# Altium project EzPowerV4 - REV09.PrjPcb (part 1 of 7)
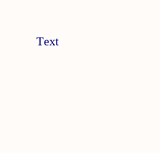
[diagram p0: Hardware_Architecture.SchDoc, left]
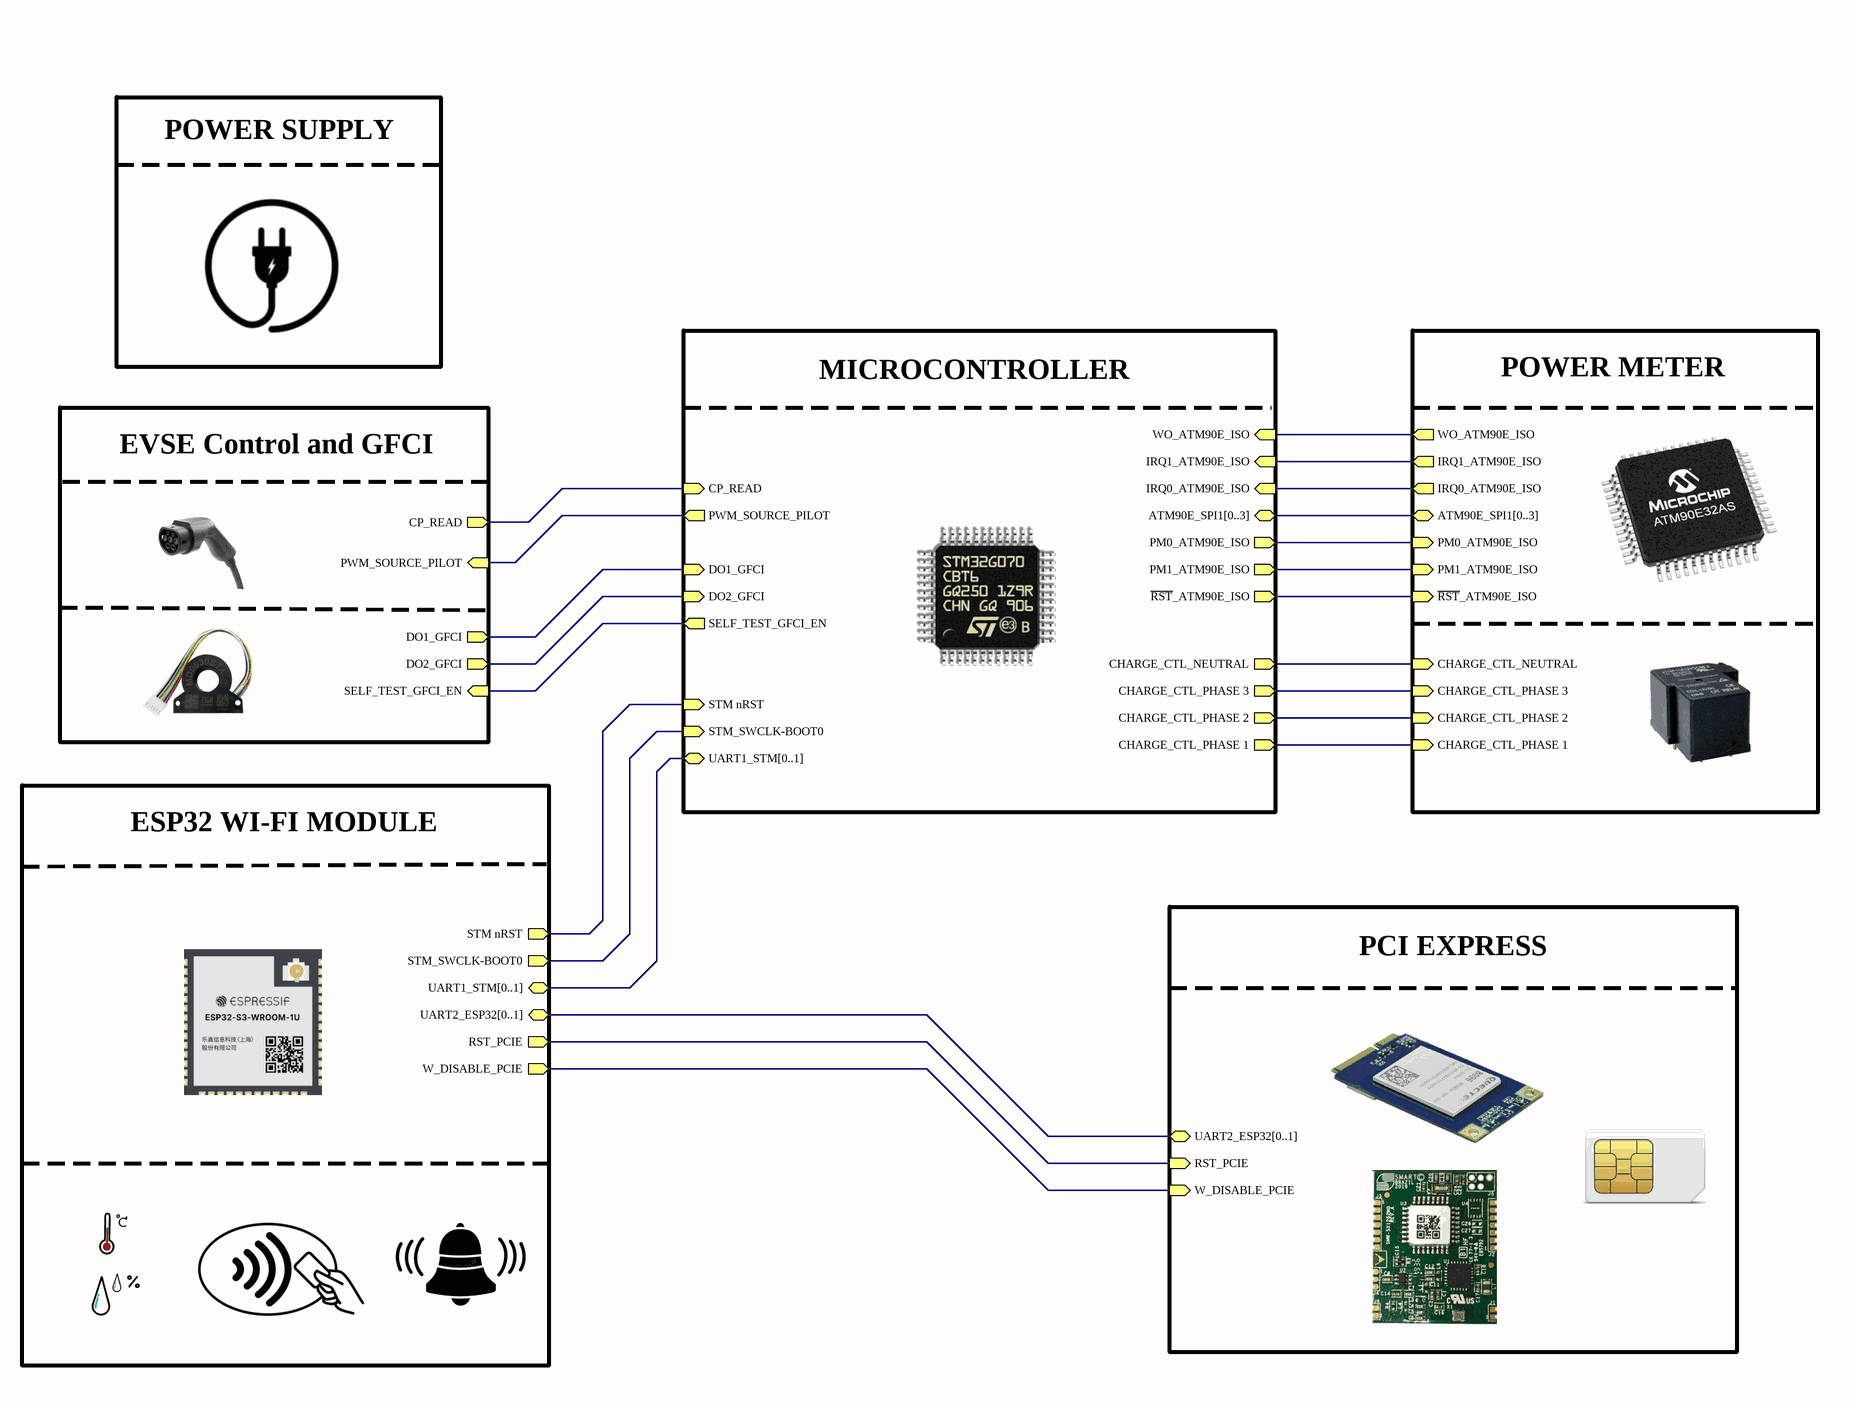
[diagram p1: Hardware_Architecture.SchDoc, right]
7 sheets, 340 parts. Net scope: global (net labels, ports and power ports of the same name join across sheets).
Board files: EzPowerV4 - REV09.PcbDoc, EzPowerV4 - REV09 - Painel x4.PcbDoc, EzPowerV4 - REV09 - Painel x2.PcbDoc
Sheets:
  Hardware_Architecture.SchDoc
    MICROCONTROLLER = Microcontroller.SchDoc
    POWER METER = Power Meter.SchDoc
    ESP32 WI-FI MODULE = ESP32 WI-FI Module.SchDoc
    PCI EXPRESS = PCI Express.SchDoc
    EVSE Control and GFCI = EVSE Control and GFCI.SchDoc
    POWER SUPPLY = Power Supply.SchDoc

## Sheet Hardware_Architecture.SchDoc: Hardware Architecture
size A2; ApprovedBy: JTS; CheckedBy: JTS; DrawnBy: EBC; DocumentNumber: -; Revision: 09; SheetNumber: 1; SheetTotal: 7; SenaiProjectName: EzPower v4

### Sub-sheets
ESP32 WI-FI MODULE = ESP32 WI-FI Module.SchDoc: RST_PCIE (out), W_DISABLE_PCIE (out), UART2_ESP32[0..1] (bidir), UART1_STM[0..1] (bidir), STM_SWCLK-BOOT0 (out), STM nRST (out)
EVSE Control and GFCI = EVSE Control and GFCI.SchDoc: PWM_SOURCE_PILOT (in), CP_READ (out), DO2_GFCI (out), DO1_GFCI (out), SELF_TEST_GFCI_EN (in)
MICROCONTROLLER = Microcontroller.SchDoc: PWM_SOURCE_PILOT (out), CP_READ (in), PM0_ATM90E_ISO (out), PM1_ATM90E_ISO (out), IRQ1_ATM90E_ISO (in), IRQ0_ATM90E_ISO (in), WO_ATM90E_ISO (in), ~{RST}_ATM90E_ISO (out), UART1_STM[0..1] (bidir), ATM90E_SPI1[0..3] (bidir), CHARGE_CTL_NEUTRAL (out), CHARGE_CTL_PHASE 3 (out), CHARGE_CTL_PHASE 2 (out), CHARGE_CTL_PHASE 1 (out), SELF_TEST_GFCI_EN (out), DO2_GFCI (in), DO1_GFCI (in), STM nRST (in), STM_SWCLK-BOOT0 (in)
PCI EXPRESS = PCI Express.SchDoc: RST_PCIE (in), UART2_ESP32[0..1] (bidir), W_DISABLE_PCIE (in)
POWER METER = Power Meter.SchDoc: IRQ1_ATM90E_ISO (out), IRQ0_ATM90E_ISO (out), WO_ATM90E_ISO (out), PM1_ATM90E_ISO (in), PM0_ATM90E_ISO (in), ~{RST}_ATM90E_ISO (in), ATM90E_SPI1[0..3] (bidir), CHARGE_CTL_PHASE 2 (in), CHARGE_CTL_PHASE 1 (in), CHARGE_CTL_NEUTRAL (in), CHARGE_CTL_PHASE 3 (in)
POWER SUPPLY = Power Supply.SchDoc: no entries

### Nets
(unnamed): sheet MICROCONTROLLER/PWM_SOURCE_PILOT, sheet EVSE Control and GFCI/PWM_SOURCE_PILOT
(unnamed): sheet MICROCONTROLLER/CP_READ, sheet EVSE Control and GFCI/CP_READ
(unnamed): sheet MICROCONTROLLER/PM0_ATM90E_ISO, sheet POWER METER/PM0_ATM90E_ISO
(unnamed): sheet MICROCONTROLLER/PM1_ATM90E_ISO, sheet POWER METER/PM1_ATM90E_ISO
(unnamed): sheet MICROCONTROLLER/IRQ1_ATM90E_ISO, sheet POWER METER/IRQ1_ATM90E_ISO
(unnamed): sheet MICROCONTROLLER/IRQ0_ATM90E_ISO, sheet POWER METER/IRQ0_ATM90E_ISO
(unnamed): sheet MICROCONTROLLER/~{RST}_ATM90E_ISO, sheet POWER METER/~{RST}_ATM90E_ISO
(unnamed): sheet MICROCONTROLLER/CHARGE_CTL_PHASE 3, sheet POWER METER/CHARGE_CTL_PHASE 3
(unnamed): sheet MICROCONTROLLER/CHARGE_CTL_PHASE 2, sheet POWER METER/CHARGE_CTL_PHASE 2
(unnamed): sheet MICROCONTROLLER/CHARGE_CTL_PHASE 1, sheet POWER METER/CHARGE_CTL_PHASE 1
(unnamed): sheet MICROCONTROLLER/SELF_TEST_GFCI_EN, sheet EVSE Control and GFCI/SELF_TEST_GFCI_EN
(unnamed): sheet MICROCONTROLLER/DO2_GFCI, sheet EVSE Control and GFCI/DO2_GFCI
(unnamed): sheet MICROCONTROLLER/STM nRST, sheet ESP32 WI-FI MODULE/STM nRST
(unnamed): sheet MICROCONTROLLER/STM_SWCLK-BOOT0, sheet ESP32 WI-FI MODULE/STM_SWCLK-BOOT0
(unnamed): sheet ESP32 WI-FI MODULE/RST_PCIE, sheet PCI EXPRESS/RST_PCIE
(unnamed): sheet ESP32 WI-FI MODULE/W_DISABLE_PCIE, sheet PCI EXPRESS/W_DISABLE_PCIE

### Buses and harness runs
bus sheet ESP32 WI-FI MODULE/UART1_STM[0..1] = sheet MICROCONTROLLER/UART1_STM[0..1]
bus sheet ESP32 WI-FI MODULE/UART2_ESP32[0..1] = sheet PCI EXPRESS/UART2_ESP32[0..1]

### Notes on the sheet
- Text
- Title:
- Size:
- Project:
- Revision:
- Date:
- Time:
- Variant:
- Drawn by:
- Checked by:
- A2
- Approved by:
- Sheet
- of

## Sheet Microcontroller.SchDoc: Microcontroller
size A2; ApprovedBy: JTS; CheckedBy: JTS; DrawnBy: EBC; DocumentNumber: -; Revision: 09; SheetNumber: 4; SheetTotal: 7; SenaiProjectName: EzPower v4
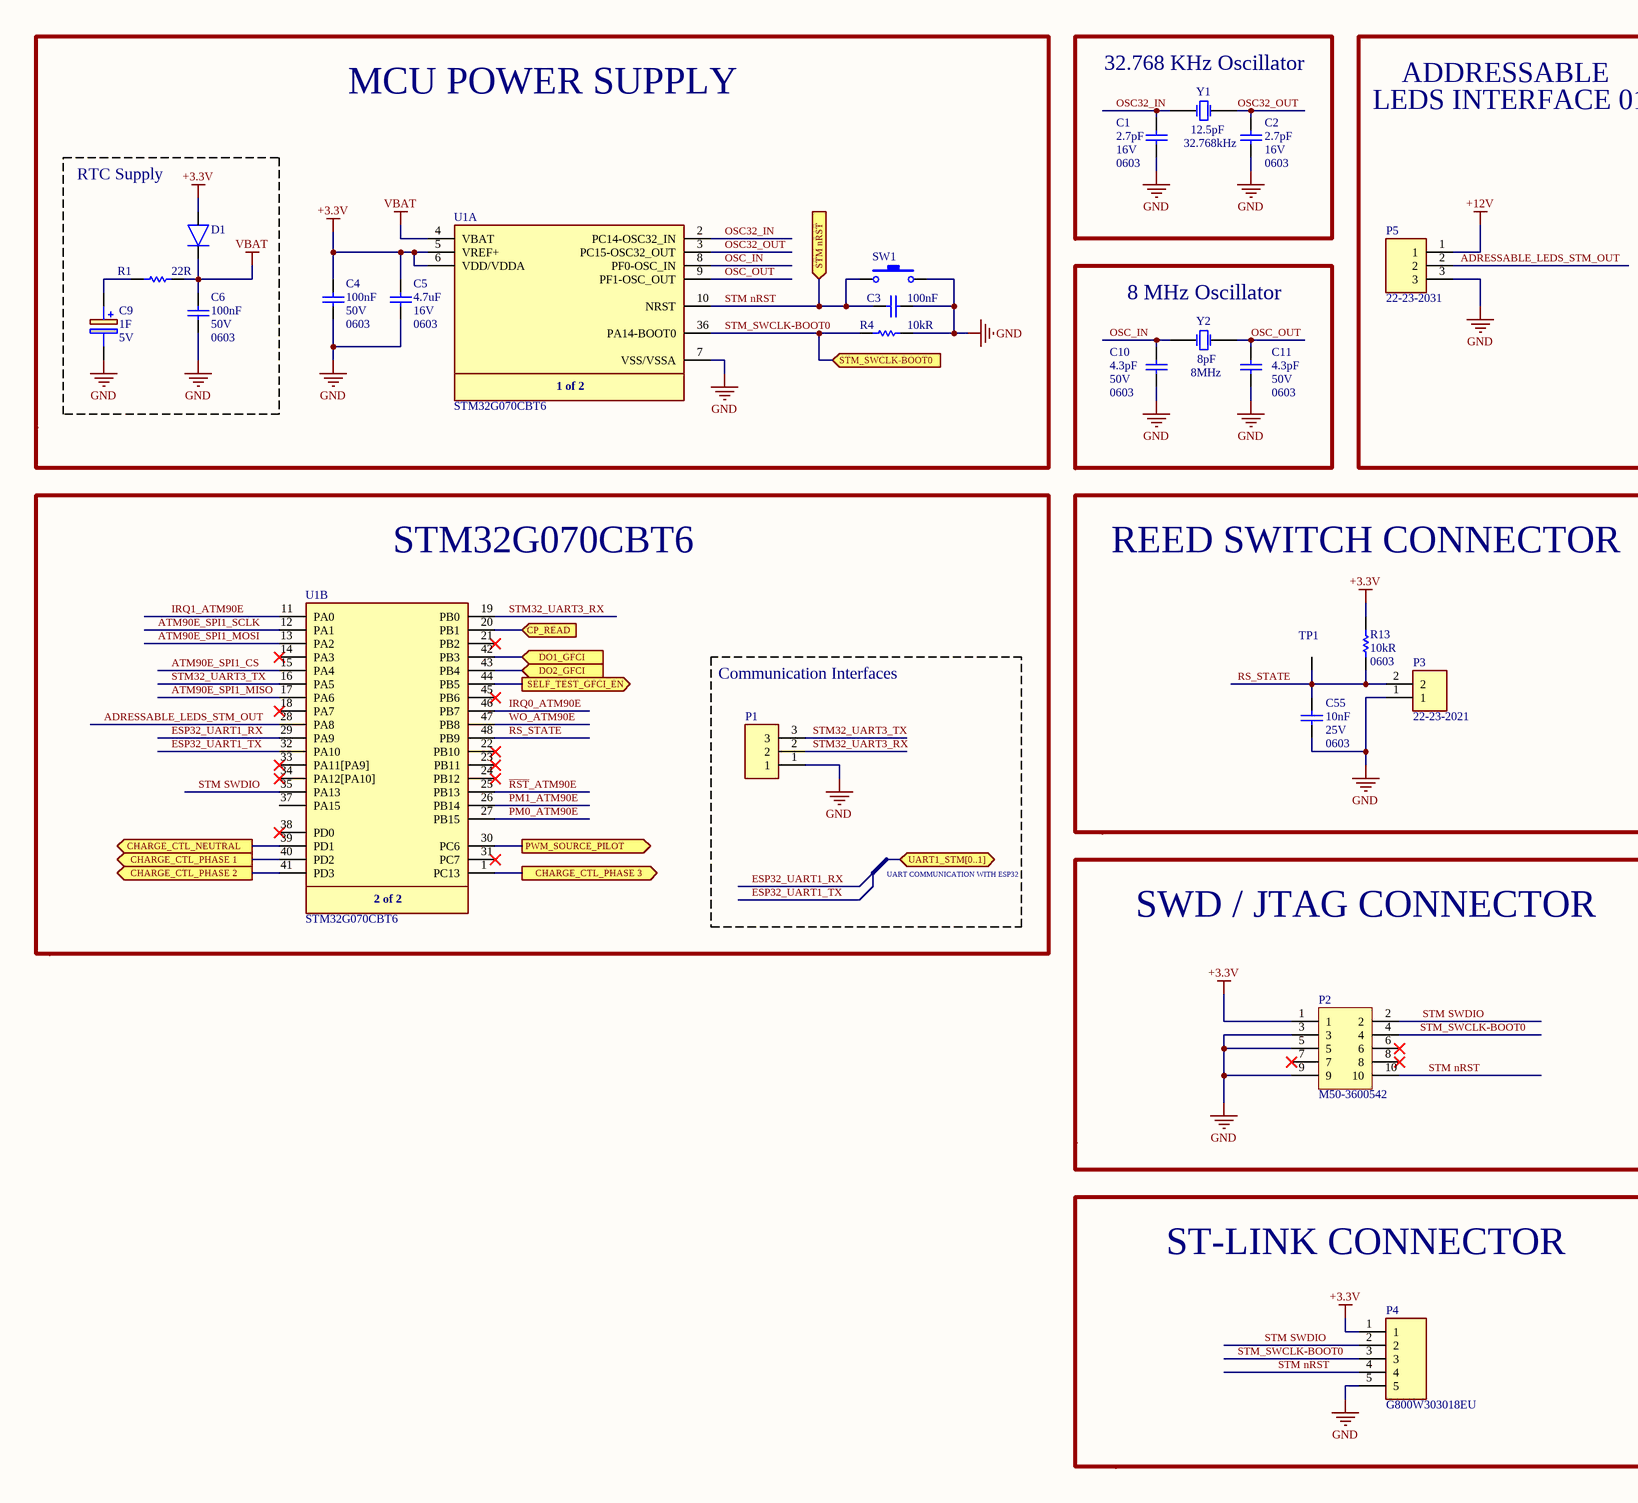
[diagram p2: Microcontroller.SchDoc, left]
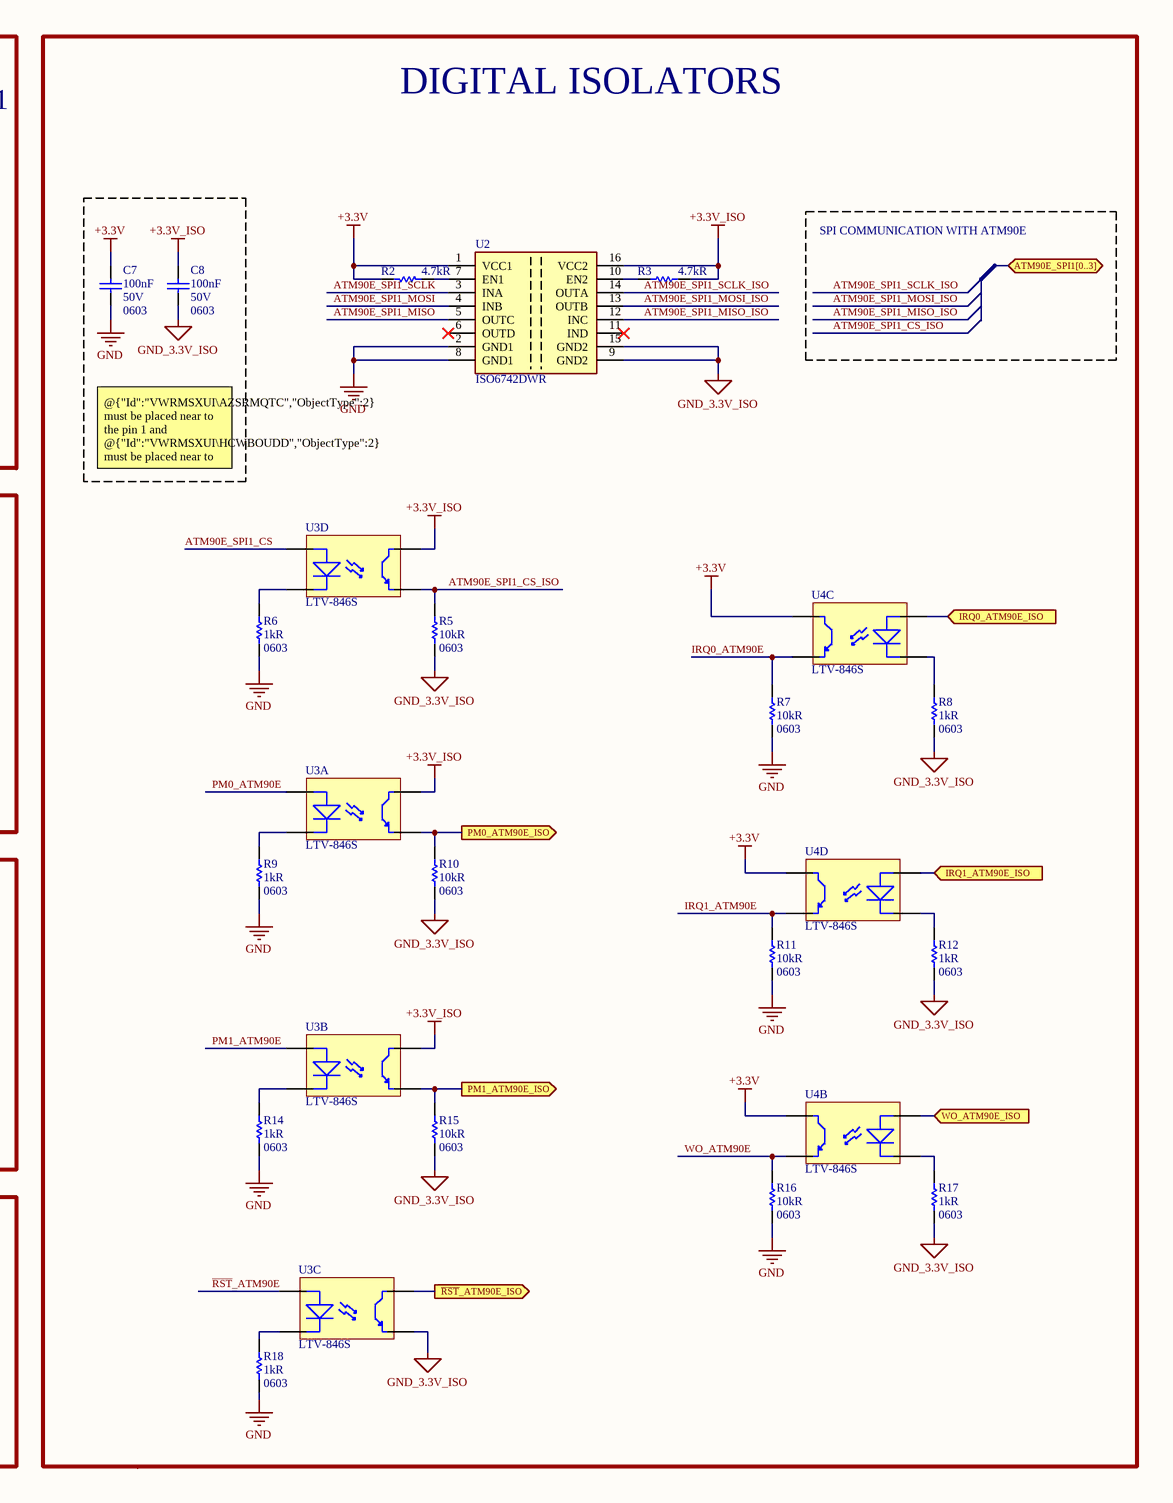
[diagram p3: Microcontroller.SchDoc, right]

### Parts
C1  Voltage Rating (DC): 16V  Case Code (Imperial): 0603  Capacitance: 2.7pF  [C0603]  (hidden comment: VJ0603A2R7DXJPW1BC)
C2  Voltage Rating (DC): 16V  Case Code (Imperial): 0603  Capacitance: 2.7pF  [C0603]  (hidden comment: VJ0603A2R7DXJPW1BC)
C3  value 100nF  [C0603]  (hidden comment: CC0603MRX7R9BB104)
C4  value 100nF  Case/Package: 0603  Voltage Rating: 50V  [C0603]  (hidden comment: CC0603MRX7R9BB104)
C5  value 4.7uF  Case Code (Imperial): 0603  Voltage Rating: 16V  [C0603]  (hidden comment: CL10A475KO8NNNC)
C6  value 100nF  Case/Package: 0603  Voltage Rating: 50V  [C0603]  (hidden comment: CC0603MRX7R9BB104)
C7  value 100nF  Case/Package: 0603  Voltage Rating: 50V  [C0603]  (hidden comment: CC0603MRX7R9BB104)
C8  value 100nF  Case/Package: 0603  Voltage Rating: 50V  [C0603]  (hidden comment: CC0603MRX7R9BB104)
C9  value 1F  Voltage Rating: 5V  [CAP 8MMX18MM]  (hidden comment: SCMR18C105PRBA0)
C10  value 4.3pF  Case Code (Imperial): 0603  Voltage Rating: 50V  [C0603]  (hidden comment: CC0603CRNPO9BN4R3)
C11  value 4.3pF  Case Code (Imperial): 0603  Voltage Rating: 50V  [C0603]  (hidden comment: CC0603CRNPO9BN4R3)
C55  Voltage Rating: 25V  Capacitance: 10nF  Case Code (Imperial): 0603  [C0603]  (hidden comment: C_0603_0.01uF_25V_10%)
D1  1N4448W-TP  [SOD123]  (value not drawn)
P1  10129378-903001BLF  [HEADER_2.54MM_3POS_PTH]  (value not drawn)
P2  M50-3600542  [HEADER_10POS_1.27MM_SMT]
P3  22-23-2021  [HEADER_KK_2.54MM_2POS]
P4  G800W303018EU  [HEADER_2.54MM_5POS]
P5  22-23-2031  [HEADER_2.54MM_3POS]
R1  Resistance: 22R  [R0603]  (hidden comment: CRCW060322R0FKEAC)
R2  Resistance: 4.7kR  [R0603]  (hidden comment: R_0603_4.7k_1%_1/10W)
R3  Resistance: 4.7kR  [R0603]  (hidden comment: R_0603_4.7k_1%_1/10W)
R4  value 10kR  [R0603]  (hidden comment: CRCW060310K0JNEBC)
R5  value 10kR  Case/Package: 0603  [R0603]  (hidden comment: CRCW060310K0JNEBC)
R6  Size Code: 0603  Resistance: 1kR  [R0603]  (hidden comment: R_0603_1kR_1%_1/10W)
R7  value 10kR  Case/Package: 0603  [R0603]  (hidden comment: CRCW060310K0JNEBC)
R8  Size Code: 0603  Resistance: 1kR  [R0603]  (hidden comment: R_0603_1kR_1%_1/10W)
R9  Size Code: 0603  Resistance: 1kR  [R0603]  (hidden comment: R_0603_1kR_1%_1/10W)
R10  value 10kR  Case/Package: 0603  [R0603]  (hidden comment: CRCW060310K0JNEBC)
R11  value 10kR  Case/Package: 0603  [R0603]  (hidden comment: CRCW060310K0JNEBC)
R12  Size Code: 0603  Resistance: 1kR  [R0603]  (hidden comment: R_0603_1kR_1%_1/10W)
R13  value 10kR  Case/Package: 0603  [R0603]  (hidden comment: CRCW060310K0JNEBC)
R14  Size Code: 0603  Resistance: 1kR  [R0603]  (hidden comment: R_0603_1kR_1%_1/10W)
R15  value 10kR  Case/Package: 0603  [R0603]  (hidden comment: CRCW060310K0JNEBC)
R16  value 10kR  Case/Package: 0603  [R0603]  (hidden comment: CRCW060310K0JNEBC)
R17  Size Code: 0603  Resistance: 1kR  [R0603]  (hidden comment: R_0603_1kR_1%_1/10W)
R18  Size Code: 0603  Resistance: 1kR  [R0603]  (hidden comment: R_0603_1kR_1%_1/10W)
SW1  PTS810SJM250SMTRLFS  [PUSH BUTTON 4.2mm x 3.2 mm]  (value not drawn)
TP1  S2761-46R  [TP_S276146R]  (value not drawn)
U1  STM32G070CBT6  [LQFP-48]  (parts A,B of 2)
U2  ISO6742DWR  [SOIC-16]
U3  LTV-846S  [PDIP-16]  (parts A,B,C,D of 4)
U4  LTV-846S  [PDIP-16]  (parts B,C,D of 4)
Y1  Load Capacitance: 12.5pF  Frequency: 32.768kHz  [Y32.768KHz]  (hidden comment: FK135EIHM0.032768-T3)
Y2  Frequency: 8MHz  Load Capacitance: 8pF  [Y8MHz]  (hidden comment: NX5032GA-8.000M-STD-CSU-1)

### Blocks framed on the sheet
MCU POWER SUPPLY: C3-C5 R4 SW1 U1
32.768 KHz Oscillator: C1 C2 Y1
DIGITAL ISOLATORS: C7 C8 R2 R3 R5-R12 R14-R18 U2-U4
RTC Supply: C6 C9 D1 R1
8 MHz Oscillator: C10 C11 Y2
STM32G070CBT6: U1
REED SWITCH CONNECTOR: C55 P3 R13 TP1
Communication Interfaces: P1
SWD / JTAG CONNECTOR: P2
ST-LINK CONNECTOR: P4

### Ports
ATM90E_SPI1[0..3] (bidir), CHARGE_CTL_NEUTRAL (out), CHARGE_CTL_PHASE 1 (out), CHARGE_CTL_PHASE 2 (out), CHARGE_CTL_PHASE 3 (out), CP_READ (in), DO1_GFCI (in), DO2_GFCI (in), IRQ0_ATM90E_ISO (in), IRQ1_ATM90E_ISO (in), PM0_ATM90E_ISO (out), PM1_ATM90E_ISO (out), PWM_SOURCE_PILOT (out), SELF_TEST_GFCI_EN (out), STM nRST (in), STM_SWCLK-BOOT0 (in), UART1_STM[0..1] (bidir), WO_ATM90E_ISO (in), ~{RST}_ATM90E_ISO (out)

### Nets
+3.3V: C4.2 C5.2 C7.1 D1.2(A) P2.1 P4.1 R2.2 R13.2 U1.5(VREF+) U1.6(VDD/VDDA) U2.1(VCC1) U4.10(C4) U4.12(C3) U4.14(C2)
+3.3V_ISO: C8.1 R3.2 U2.16(VCC2) U3.10(C4) U3.14(C2) U3.16(C1)
+12V: P5.1
GND: C1.1 C2.1 C3.2 C4.1 C5.1 C6.1 C7.2 C9.2(-) C10.1 C11.1 C55.1 P1.1 P2.3 P2.5 P2.9 P3.1 P4.5 P5.3 R4.2 R6.2 R7.1 R9.2 R11.1 R14.2 R16.1 R18.2 SW1.3 U1.7(VSS/VSSA) U2.2(GND1) U2.8(GND1)  [project net EARTH]
GND_3.3V_ISO: C8.2 R5.1 R8.2 R10.1 R12.2 R15.1 R17.2 U2.9(GND2) U2.15(GND2) U3.11(E3)
VBAT: C6.2 D1.1(K) R1.2 U1.4(VBAT)
ADRESSABLE_LEDS_STM_OUT: P5.2 U1.28(PA8)
ATM90E_SPI1_CS: U1.15(PA4) U3.7(A4)
ATM90E_SPI1_CS_ISO: R5.2 U3.9(E4)
ATM90E_SPI1_MISO: U1.17(PA6) U2.5(OUTC)
ATM90E_SPI1_MISO_ISO: U2.12(INC)
ATM90E_SPI1_MOSI: U1.13(PA2) U2.4(INB)
ATM90E_SPI1_MOSI_ISO: U2.13(OUTB)
ATM90E_SPI1_SCLK: U1.12(PA1) U2.3(INA)
ATM90E_SPI1_SCLK_ISO: U2.14(OUTA)
DO1_GFCI: U1.42(PB3) ; port DO1_GFCI
DO2_GFCI: U1.43(PB4) ; port DO2_GFCI
ESP32_UART1_RX: U1.29(PA9)
ESP32_UART1_TX: U1.32(PA10)
IRQ0_ATM90E: R7.2 U1.46(PB7) U4.11(E3)
IRQ1_ATM90E: R11.2 U1.11(PA0) U4.9(E4)
OSC32_IN: C1.2 U1.2(PC14-OSC32_IN) Y1.2(OSC2)
OSC32_OUT: C2.2 U1.3(PC15-OSC32_OUT) Y1.1(OSC1)
OSC_IN: C10.2 U1.8(PF0-OSC_IN) Y2.2(OSC2)
OSC_OUT: C11.2 U1.9(PF1-OSC_OUT) Y2.1(OSC1)
PM0_ATM90E: U1.27(PB15) U3.1(A1)
PM1_ATM90E: U1.26(PB14) U3.3(A2)
~{RST}_ATM90E: U1.25(PB13) U3.5(A3)
RS_STATE: C55.2 P3.2 R13.1 TP1.1 U1.48(PB9)
SELF_TEST_GFCI_EN: U1.44(PB5) ; port SELF_TEST_GFCI_EN
STM32_UART3_RX: P1.2 U1.19(PB0)
STM32_UART3_TX: P1.3 U1.16(PA5)
STM nRST: C3.1 P2.10 P4.4 SW1.1 U1.10(NRST) ; port STM nRST
STM SWDIO: P2.2 P4.2 U1.35(PA13)
STM_SWCLK-BOOT0: P2.4 P4.3 R4.1 U1.36(PA14-BOOT0) ; port STM_SWCLK-BOOT0
WO_ATM90E: R16.2 U1.47(PB8) U4.13(E2)
NetC9_1: C9.1(+) R1.1
NetC22_1: U3.12(C3) ; port ~{RST}_ATM90E_ISO
NetC69_1: U1.20(PB1) ; port CP_READ
NetR2_1: R2.1 U2.7(EN1)
NetR3_1: R3.1 U2.10(EN2)
NetR6_1: R6.1 U3.8(K4)
NetR8_1: R8.1 U4.6(K3)
NetR9_1: R9.1 U3.2(K2)
NetR10_2: R10.2 U3.15(E1) ; port PM0_ATM90E_ISO
NetR12_1: R12.1 U4.8(K4)
NetR14_1: R14.1 U3.4(K2)
NetR15_2: R15.2 U3.13(E2) ; port PM1_ATM90E_ISO
NetR17_1: R17.1 U4.4(K2)
NetR18_1: R18.1 U3.6(K3)
NetR30_1: U1.40(PD2) ; port CHARGE_CTL_PHASE 1
NetR31_1: U1.41(PD3) ; port CHARGE_CTL_PHASE 2
NetR35_1: U1.1(PC13) ; port CHARGE_CTL_PHASE 3
NetR36_1: U1.39(PD1) ; port CHARGE_CTL_NEUTRAL
NetU1_30: U1.30(PC6) ; port PWM_SOURCE_PILOT
NetU4_3: U4.3(A2) ; port WO_ATM90E_ISO
NetU4_5: U4.5(A3) ; port IRQ0_ATM90E_ISO
NetU4_7: U4.7(A4) ; port IRQ1_ATM90E_ISO

Not connected (* = marked no-connect by the designer): P2 6* 7* 8*; U1 14(PA3)* 18(PA7)* 21(PB2)* 22(PB10)* 23(PB11)* 24(PB12)* 31(PC7)* 33(PA11[PA9])* 34(PA12[PA10])* 37(PA15) 38(PD0)* 45(PB6)*; U2 6(OUTD)* 11(IND)*

### Notes on the sheet
- ADDRESSABLE
- LEDS INTERFACE 01
- SPI COMMUNICATION WITH ATM90E
- @{"Id":"VWRMSXUI\AZSRMQTC","ObjectType":2} must be placed near to the pin 1 and @{"Id":"VWRMSXUI\HCWBOUDD","ObjectType":2} must be placed near to the pin 16 of the @{"Id":"VWRMSXUI\QUCTYZVT","ObjectType":2}.
- UART COMMUNICATION WITH ESP32
- Title:
- Size:
- Project:
- Revision:
- Date:
- Time:
- Variant:
- Drawn by:
- Checked by:
- A2
- Approved by:
- Sheet
- of
- (in symbol U_STM32G070CBT6_LQFP-48, part A) 1 of 2
- (in symbol U_STM32G070CBT6_LQFP-48, part B) 2 of 2

### Library data of the parts
C1 C2 = C_0603_2.7pF_±0.5pF_16V: Multilayer Ceramic Capacitors MLCC - SMD/SMT 0603 2.7pF 16volts C0G +/-0.5pF; Manufacturer: Vishay Vitramon; Supplier 1: Mouser; Manufacturer Part Number: VJ0603A2R7DXJPW1BC; Stock 1: 13349; Pricing 1: 1=0.11, 10=0.11, 50=0.063, 100=0.052, 1000=0.03, 10000=0.03 (USD); Mount: Surface Mount; Case/Package: 0603; Case Code (Metric): 1608; Min Operating Temperature: -55°C; Max Operating Temperature: 125°C; Package Quantity: 15000; Packaging: Tape and Reel; Dielectric: C0G; Termination: SMD/SMT; Series: VJ W1BC; Construction: Flat; Length: 1.6mm; Width: 0.8mm; Height: 0.95mm; Depth: 0.8mm; ComponentLink1URL: http://www.vishay.com/docs/28548/vjw1bcbascomseries.pdf?src-supplier=Avnet; ComponentLink1Description: http://www.vishay.com/docs/28548/vjw1bcbascomseries.pdf?src-supplier=Avnet; Supplier 2: Digi-Key; Supplier Part Number 1: 77-VJ0603A2R7DXJPBC; Supplier Part Number 2: VJ0603A2R7DXJPW1BC-ND
C3 C4 C6-C8 = C_0603_0.1uF_50V_20%: Cap Ceramic 50V 20% +Tol 20% -Tol X7R 15% TC 0.1uF SMD 0603; Manufacturer: Yageo; Supplier 1: Arrow Electronics; Manufacturer Part Number: CC0603MRX7R9BB104; RoHS: Yes; Category: Ceramic Capacitors; Stock 1: 19775; Pricing 1: 4000=0,00850, 8000=0,00780, 12000=0,00740, 28000=0,00700, 100000=0,00520 (USD); Mounting Technology: Surface Mount; Case Code (Imperial): 0603; Case Code (Metric): 1608; Min Operating Temperature: -55°C; Max Operating Temperature: 125°C; Packaging: Tape and Reel; Tolerance: 20%; Dielectric: X7R; Voltage Rating (DC): 50V; Series: CC; Length: 0.063inch; Width: 0.031inch; Thickness: 0.035inch; Lead Free: Lead Free; Halogen Free: Halogen Free; RoHS Compliant: Yes; ComponentLink1URL: http://www.yageo.com/documents/recent/UPY-GPHC_X7R_6.3V-to-50V_18.pdf?src-supplier=Digi-Key; ComponentLink1Description: http://www.yageo.com/documents/recent/UPY-GPHC_X7R_6.3V-to-50V_18.pdf?src-supplier=Digi-Key; ComponentLink2URL: https://www.yageo.com/upload/media/product/productsearch/datasheet/mlcc/UPY-GPHC_X7R_6.3V-to-50V_18.pdf?src-supplier=Digi-Key; ComponentLink2Description: https://www.yageo.com/upload/media/product/productsearch/datasheet/mlcc/UPY-GPHC_X7R_6.3V-to-50V_18.pdf?src-supplier=Digi-Key; ComponentLink3URL: http://www.yageo.com/exep/pages/download/literatures/ProductSelectionGuide%202014_Final_2.pdf?src-supplier=Digi-Key; ComponentLink3Description: http://www.yageo.com/exep/pages/download/literatures/ProductSelectionGuide%202014_Final_2.pdf?src-supplier=Digi-Key; Supplier Part Number 1: CC0603MRX7R9BB104
C5 = C_0603_4.7uF_16V_10%: CAP CER 4.7UF 16V X5R 0603; Manufacturer: Samsung; Material: Ceramic; Tolerance: 10%; Supplier 1: Mouser; Manufacturer Part Number: CL10A475KO8NNNC; RoHS: Yes; Category: Ceramic Capacitors; Stock 1: 437083; Pricing 1: 1=0,12000, 10=0,08600, 50=0,08600, 100=0,04100, 1000=0,02400, 10000=0,01700 (USD); Mounting Technology: Surface Mount; Case/Package: 0603; Case Code (Metric): 1608; Contact Plating: Tin; Min Operating Temperature: -55°C; Max Operating Temperature: 85°C; Packaging: Tape and Reel; Package Quantity: 1; Dielectric: X5R; Voltage: 16V; Construction: Flat; Length: 1.6mm; Width: 0.031inch; Height: 0.8mm; Thickness: 0.035inch; Depth: 0.8mm; Radiation Hardening: No; RoHS Compliant: Yes; Supplier Part Number 1: 187-CL10A475KO8NNNC; Series: CL
C9 = C_8mm x 18mm_1F_5V_ 0% / +100%: Cap 1F 5V 0% to 100% (16 X 8 X 18mm) Radial 11.5mm 65°C Bulk; Manufacturer: Kyocera AVX; ESR (Equivalent Series Resistance): 200mR; Supplier 1: Arrow Electronics; Manufacturer Part Number: SCMR18C105PRBA0; RoHS: Yes; Category: Capacitors; Stock 1: 1478; Pricing 1: 1=2,28, 10=2,106, 25=2,085, 50=1,991, 100=1,896, 500=1,678 (USD); Mounting Technology: Through Hole; Case/Package: Radial; Min Operating Temperature: -40°C; Max Operating Temperature: 85°C; Packaging: Bulk; Tolerance: 100%; Termination: PC Pins; Series: SCM; RoHS Compliant: Yes; ComponentLink1URL: http://www.farnell.com/datasheets/2675070.pdf?src-supplier=Farnell; ComponentLink1Description: http://www.farnell.com/datasheets/2675070.pdf?src-supplier=Farnell; ComponentLink2URL: https://www.avx.com/docs/techinfo/General/AVX-SuperCap-Comparison-Matrix.pdf?src-supplier=Digi-Key; ComponentLink2Description: https://www.avx.com/docs/techinfo/General/AVX-SuperCap-Comparison-Matrix.pdf?src-supplier=Digi-Key; ComponentLink3URL: http://www.farnell.com/datasheets/2675070.pdf?src-supplier=Newark; ComponentLink3Description: http://www.farnell.com/datasheets/2675070.pdf?src-supplier=Newark; Supplier Part Number 1: SCMR18C105PRBA0
C10 C11 = C_0603_4.3pF_±0.25pF_50V: Cap Ceramic 4.3pF 50V C0G 0.25pF Pad SMD 0603 125C T/R; Manufacturer: Yageo; Supplier 1: Future Electronics; Manufacturer Part Number: CC0603CRNPO9BN4R3; RoHS: Yes; Category: Ceramic Capacitors; Stock 1: 264000; Pricing 1: 4000=0,0051, 16000=0,0048, 60000=0,0045, 160000=0,0043, 400000=0,0041 (USD); Mounting Technology: Surface Mount; Case/Package: 0603; Case Code (Metric): 1608; Min Operating Temperature: -55°C; Max Operating Temperature: 125°C; Packaging: Cut Tape; Series: CC; Length: 0.063inch; Width: 0.031inch; Thickness: 0.035inch; ComponentLink1URL: http://www.yageo.com/documents/recent/UPY-GP_NP0_16V-to-50V_16.pdf?src-supplier=Digi-Key; ComponentLink1Description: http://www.yageo.com/documents/recent/UPY-GP_NP0_16V-to-50V_16.pdf?src-supplier=Digi-Key; ComponentLink2URL: https://www.yageo.com/upload/media/product/productsearch/datasheet/mlcc/UPY-GP_NP0_16V-to-50V_18.pdf?src-supplier=Digi-Key; ComponentLink2Description: https://www.yageo.com/upload/media/product/productsearch/datasheet/mlcc/UPY-GP_NP0_16V-to-50V_18.pdf?src-supplier=Digi-Key; ComponentLink3URL: http://www.yageo.com/exep/pages/download/literatures/ProductSelectionGuide%202014_Final_2.pdf?src-supplier=Digi-Key; ComponentLink3Description: http://www.yageo.com/exep/pages/download/literatures/ProductSelectionGuide%202014_Final_2.pdf?src-supplier=Digi-Key; Supplier Part Number 1: 5130881
C55 = C_0603_0.01uF_25V_10%: Surface Mount Ceramic Multilayer Capacitor 0.01uF 10% X7R 25V 0603 Paper T/R; Manufacturer: Yageo; Manufacturer Part Number: CC0603KRX7R8BB103; Insulation Resistance: 100GR; Supplier 1: RSComponents; RoHS: Yes; Category: Ceramic Capacitors; Stock 1: 36000; Pricing 1: 4000=0,00900, 8000=0,00800, 16000=0,00700 (GBP); Mount: Surface Mount; Case/Package: 0603; Number of Pins: 2; Case Code (Metric): 1608; Dielectric Material: Ceramic; Min Operating Temperature: -55°C; Max Operating Temperature: 125°C; Tolerance: 10%; Dielectric: X7R; Voltage Rating (DC): 25V; Packaging: Tape and Reel; Package Quantity: 1; Termination: SMD/SMT; Resistor Type: Ceramic; Voltage: 25V; Series: CC; Length: 1.6mm; Width: 0.8mm; Height: 0.8mm; Thickness: 0.035inch; Depth: 0.8mm; Radiation Hardening: No; RoHS Compliant: Yes; REACH SVHC: Unknown; Lead Free: Lead Free; Halogen Free: Halogen Free; ComponentLink1URL: https://datasheet.ciiva.com/26862/getdatasheetpartid-134630-26862833.pdf?src-supplier=Verical; ComponentLink1Description: https://datasheet.ciiva.com/26862/getdatasheetpartid-134630-26862833.pdf?src-supplier=Verical; ComponentLink2URL: https://datasheet.ciiva.com/8033/70765-8033820.pdf?src-supplier=Element14; ComponentLink2Description: https://datasheet.ciiva.com/8033/70765-8033820.pdf?src-supplier=Element14; ComponentLink3URL: https://datasheet.ciiva.com/7978/1489800-7978152.pdf?src-supplier=Element14; ComponentLink3Description: https://datasheet.ciiva.com/7978/1489800-7978152.pdf?src-supplier=Element14; ComponentLink4URL: https://datasheet.ciiva.com/28450/1489800-28450573.pdf?src-supplier=Element14; ComponentLink4Description: https://datasheet.ciiva.com/28450/1489800-28450573.pdf?src-supplier=Element14; ComponentLink5URL: https://datasheet.ciiva.com/46430/1734573-46430157.pdf?src-supplier=Element14; ComponentLink5Description: https://datasheet.ciiva.com/46430/1734573-46430157.pdf?src-supplier=Element14; ComponentLink6URL: https://datasheet.ciiva.com/8033/1734573-8033822.pdf?src-supplier=Element14; ComponentLink6Description: https://datasheet.ciiva.com/8033/1734573-8033822.pdf?src-supplier=Element14; ComponentLink7URL: https://datasheet.ciiva.com/144/mlccorderingcode-144150.pdf?src-supplier=Digi-Key; ComponentLink7Description: https://datasheet.ciiva.com/144/mlccorderingcode-144150.pdf?src-supplier=Digi-Key; ComponentLink8URL: https://datasheet.ciiva.com/144/mlccorderingcode-144149.pdf?src-supplier=Digi-Key; ComponentLink8Description: https://datasheet.ciiva.com/144/mlccorderingcode-144149.pdf?src-supplier=Digi-Key; ComponentLink9URL: https://datasheet.ciiva.com/144/mlccorderingcode-144151.pdf?src-supplier=Digi-Key; ComponentLink9Description: https://datasheet.ciiva.com/144/mlccorderingcode-144151.pdf?src-supplier=Digi-Key; ComponentLink10URL: https://datasheet.ciiva.com/11465/upy-gphc-x7r-6-3v-to-50v-8-11465198.pdf?src-supplier=Avnet; ComponentLink10Description: https://datasheet.ciiva.com/11465/upy-gphc-x7r-6-3v-to-50v-8-11465198.pdf?src-supplier=Avnet; Supplier Part Number 1: 6698814
D1 = D_General_1N4448W-TP: Rectifier Diode Switching 100V 0.25A 4ns 2-Pin SOD-123 T/R; Manufacturer: MCC; Forward Current: 150mA; Max Surge Current: 2A; Forward Voltage: 1V; Average Rectified Current: 250mA; Polarity: Standard; Voltage Rating (DC): 75V; Value: 4pF; Max Reverse Current: 5uA; Supplier 1: Arrow Electronics; Manufacturer Part Number: 1N4448W-TP; RoHS: Yes; Category: Rectifier Diodes; Stock 1: 36000; Pricing 1: 3000=0,04190, 6000=0,02490, 15000=0,02360, 30000=0,02150, 75000=0,01960, 150000=0,01050 (USD); Mounting Technology: Surface Mount; Weight: 0.001058oz; Min Operating Temperature: -55°C; Max Operating Temperature: 150°C; Packaging: Cut Tape; Recovery Time: 4ns; Package Quantity: 3000; Reverse Recovery Time: 4ns; Current Rating: 150mA; Output Current: 150mA; Max Reverse Voltage (DC): 75V; Series: -; Length: 2.85mm; Width: 1.8mm; Height: 1.2mm; Lead Free: Lead Free; RoHS Compliant: Yes; ComponentLink1URL: https://datasheet.ciiva.com/916/1n4448wsod-123-916907.pdf?src-supplier=Digi-Key; ComponentLink1Description: https://datasheet.ciiva.com/916/1n4448wsod-123-916907.pdf?src-supplier=Digi-Key; Supplier Part Number 1: 1N4448W-TP
P1 = P_HEADER_3POS_2.54MM_PTH: Headers & Wire Housings 2.54MM VT ECONOSTIK HDR; Manufacturer: AMPHENOL ICC (FCI); Supplier 1: Newark; RoHS: No; Supplier Part Number 1: 45AC1098; Manufacturer Part Number: 10129378-903001BLF
P2 = P_Harwin_HEADER_10POS_1.27MM_SMT: Headers & Wire Housings 5+5 DIL PIN HDR SMT Au/Sn; Manufacturer: Harwin; Number of Contacts: 10; Max Current Rating: 1A; Contact Resistance: 30mR; Gender: Male; Insulation Resistance: 5GR; Pitch: 1.27mm; Row Spacing: 0.05inch; Supplier 1: Mouser; Stock 1: 4230; Pricing 1: 1=1.22, 10=0.969, 100=0.842, 500=0.758, 1000=0.674, 2000=0.611, 5000=0.59, 10000=0.56, 25000=0.539 (USD); Mount: Surface Mount; Contact Plating: Gold; Contact Material: Copper Alloy; Housing Material: Thermoplastic; Color: Black; Material: Thermoplastic; Insulation Material: Thermoplastic; Min Operating Temperature: -40°C; Max Operating Temperature: 105°C; Number of Rows: 2; Termination: Solder; Orientation: Straight; Package Quantity: 1000; Packaging: Tray; Current Rating: 1A; Number of Positions: 10; Length: 6.35mm; Depth: 3.41mm; Contact Mating Length: 0.118inch; Radiation Hardening: No; REACH SVHC: No SVHC; ComponentLink1URL: http://www.mouser.com/ds/2/181/M50-360-350131.pdf?src-supplier=Mouser; ComponentLink1Description: http://www.mouser.com/ds/2/181/M50-360-350131.pdf?src-supplier=Mouser; ComponentLink2URL: http://www.farnell.com/datasheets/2368223.pdf?src-supplier=Farnell; ComponentLink2Description: http://www.farnell.com/datasheets/2368223.pdf?src-supplier=Farnell; ComponentLink3URL: http://uk.rs-online.com/webdocs/1388/0900766b81388736.pdf?src-supplier=RSComponents; ComponentLink3Description: http://uk.rs-online.com/webdocs/1388/0900766b81388736.pdf?src-supplier=RSComponents; ComponentLink4URL: https://cdn.harwin.com/pdfs/Harwin_PC_Connectors_Archer.pdf?src-supplier=Digi-Key; ComponentLink4Description: https://cdn.harwin.com/pdfs/Harwin_PC_Connectors_Archer.pdf?src-supplier=Digi-Key; ComponentLink5URL: http://www.farnell.com/datasheets/2368223.pdf?src-supplier=Element14; ComponentLink5Description: http://www.farnell.com/datasheets/2368223.pdf?src-supplier=Element14; ComponentLink6URL: https://www.distrelec.biz/Web/Downloads/14/18/04391418.pdf?mime=application%2Fpdf&src-supplier=Distrelec; ComponentLink6Description: https://www.distrelec.biz/Web/Downloads/14/18/04391418.pdf?mime=application%2Fpdf&src-supplier=Distrelec; ComponentLink7URL: https://www.verical.com/server-webapp/html/getDatasheet?partID=136574&src-supplier=Verical; ComponentLink7Description: https://www.verical.com/server-webapp/html/getDatasheet?partID=136574&src-supplier=Verical; Supplier Part Number 1: 855-M50-3600542; Manufacturer Part Number: M50-3600542
P3 = P_Molex_HEADER_2POS_2.54MM_PTH: KK 254 Solid Header, Vertical, with Friction Lock, 2 Circuits, Tin (Sn) Plating; Manufacturer: Molex; Contact Resistance: 10mR; Number of Contacts: 2; Number of Circuits: 2NUMBER; Gender: 29Gender; Voltage Rating: 250V; Current Rating: 4A; Insulation Resistance: 500GR; Pitch: 2.54mm; Glow Wire Compliant: 16Compliance; Approvals: UL,CSA; Supplier 1: Mouser; RoHS: Yes; Category: Headers and Wire Housings; Stock 1: 76100; Pricing 1: 1=0,21, 10=0,124, 50=0,124, 100=0,096, 1000=0,086, 10000=0,073 (USD); Mounting Technology: Through Hole; Contact Plating: Tin,Copper; Contact Material: Brass; Color: White; Housing Color: White; Housing Material: Nylon; Min Operating Temperature: 0°C; Max Operating Temperature: 75°C; Orientation: Straight; Termination: Solder; Number of Rows: 1; Packaging: Bulk; Package Quantity: 3000; Number of Positions: 2; Series: KK; Voltage Rating (DC): 250V; Max Current Rating: 4A; Fastening Type: Friction; Contact Type: Male Pin; Length: 5.08mm; Height: 10.67mm; Depth: 6.35mm; Contact Mating Length: 0.295inch; Radiation Hardening: No; RoHS Compliant: Yes; Flammability Rating: UL94 V-0; Reach SVHC Compliant: Unknown; Lead Free: 5697LeadFree; Halogen Free: 5696HalogenFree; Supplier Part Number 1: 538-22-23-2021; Manufacturer Part Number: 22-23-2021
P4 = P_Header_5POS_2.54MM_PTH: Board to Board Connector Straight Header Single Row 5 Position 2.54mm Pitch Through Hole Bag; Manufacturer: Amphenol; Supplier 1: Arrow Electronics; Manufacturer Part Number: G800W303018EU; RoHS: Yes; Category: Connectors; Stock 1: 40000; Pricing 1: 20000=0,0318 (USD); RoHS Compliant: Yes; Supplier Part Number 1: G800W303018EU
P5 = P_Molex_HEADER_3POS_2.54MM_PTH: KK 254 Solid Header, Vertical, with Friction Lock, 3 Circuits, Tin (Sn) Plating, Bag; Manufacturer: Molex; Number of Contacts: 3; Contact Resistance: 10mR; Gender: Male; Current Rating: 4A; Voltage Rating: 250V; Insulation Resistance: 500GR; Pitch: 2.54mm; Approvals: UL,CSA; Glow Wire Compliant: Non-compliant; Supplier 1: Mouser; RoHS: Yes; Category: Headers and Wire Housings; Stock 1: 71734; Pricing 1: 1=0,28000, 10=0,22400, 50=0,22400, 100=0,19700, 1000=0,16200, 10000=0,13900 (USD); Mounting Technology: Through Hole; Contact Plating: Tin,Copper; Contact Material: Brass; Color: White; Housing Color: White; Housing Material: Nylon; Min Operating Temperature: 0°C; Max Operating Temperature: 75°C; Number of Rows: 1; Termination: Solder; Orientation: Straight; Packaging: Bulk; Series: 6373; Max Current Rating: 4A; Package Quantity: 16000; Contact Gender: Male; Number of Positions: 3; Voltage Rating (DC): 250V; Number of Circuits: 3; Length: 7.62mm; Height: 10.67mm; Depth: 6.35mm; Lead Pitch: 2.54mm; Radiation Hardening: No; RoHS Compliant: Yes; Flammability Rating: UL94 V-0; Halogen Free: Low Halogen; Lead Free: Lead Free; Reach SVHC Compliant: Unknown; ComponentLink1URL: https://datasheet.ciiva.com/5158/0022232031-pcb-headers-227465-5158252.pdf?src-supplier=Mouser; ComponentLink1Description: https://datasheet.ciiva.com/5158/0022232031-pcb-headers-227465-5158252.pdf?src-supplier=Mouser; ComponentLink2URL: https://datasheet.ciiva.com/19461/1966237-19461008.pdf?src-supplier=Jameco; ComponentLink2Description: https://datasheet.ciiva.com/19461/1966237-19461008.pdf?src-supplier=Jameco; ComponentLink3URL: https://datasheet.ciiva.com/19472/232274-19472863.pdf?src-supplier=Jameco; ComponentLink3Description: https://datasheet.ciiva.com/19472/232274-19472863.pdf?src-supplier=Jameco; ComponentLink4URL: https://datasheet.ciiva.com/11746/0900766b80d8f4d1-11746118.pdf?src-supplier=Rs; ComponentLink4Description: https://datasheet.ciiva.com/11746/0900766b80d8f4d1-11746118.pdf?src-supplier=Rs; ComponentLink5URL: https://datasheet.ciiva.com/30177/930022232031-pcb-headers-30177655.pdf?src-supplier=Onlinecomponents.com; ComponentLink5Description: https://datasheet.ciiva.com/30177/930022232031-pcb-headers-30177655.pdf?src-supplier=Onlinecomponents.com; ComponentLink6URL: https://datasheet.ciiva.com/9468/0022232031-pcb-headers-9468262.pdf?src-supplier=Avnet; ComponentLink6Description: https://datasheet.ciiva.com/9468/0022232031-pcb-headers-9468262.pdf?src-supplier=Avnet; ComponentLink7URL: https://datasheet.ciiva.com/7810/1777030-7810188.pdf?src-supplier=Element14; ComponentLink7Description: https://datasheet.ciiva.com/7810/1777030-7810188.pdf?src-supplier=Element14; Supplier Part Number 1: 538-22-23-2031; Manufacturer Part Number: 22-23-2031
R1 = R_0603_22R_1%_1/10W: Thick Film Resistors - SMD 1/10Watt 22ohms 1% Commercial Use; Manufacturer: Vishay; Temperature Coefficient: 100ppm/°C; Max Power Dissipation: 100mW; Supplier 1: Mouser; Manufacturer Part Number: CRCW060322R0FKEAC; Stock 1: 59616; Pricing 1: 1=0.1, 10=0.036, 100=0.014, 500=0.009, 1000=0.005, 5000=0.004 (USD); Case/Package: 0603; Case Code (Metric): 1608; Min Operating Temperature: -55°C; Max Operating Temperature: 155°C; Composition: Thick Film; Packaging: Cut Tape; Tolerance: 1%; Number of Terminations: 2; Supplier 2: Digi-Key; Supplier Part Number 1: 71-CRCW060322R0FKEAC; Supplier Part Number 2: 541-4025-6-ND; Case Code (Imperial): 0603
R2 R3 = R_0603_4.7k_1%_1/10W: Res Thick Film 0603 4.7K Ohm 1% 0.1W(1/10W) ±100ppm/C Pad SMD T/R; Manufacturer: Mitsubishi Kamaya; Manufacturer Part Number: RMC16K472FTP; Power Rating: 100mW; Voltage Rating: 50V; Number of Resistors: 1; Mount: Surface Mount; Case/Package: 0603; Case Code (Metric): 1608; Min Operating Temperature: -55°C; Max Operating Temperature: 155°C; Tolerance: 1%; Technology: THICK FILM; Supplier 1: Mouser; RoHS: No; Category: Uncategorized; Supplier Part Number 1: 791-RMC16K472FTP; Case Code (Imperial): 0603
R4 R5 R7 R10 R11 R13 R15 R16 = R_0603_10kR_5%_1/10W: Fixed Resistor, Metal Glaze/thick Film, 0.1W, 10000ohm, 75V, 5% +/-Tol, 200ppm/Cel, Surface Mount, 0603; Manufacturer: Vishay; Power: 100mW; Temperature Coefficient: -200200ppm/°C; Package Height: 0.45mm; Package Length: 1.6mm; Package Width: 0.8mm; Supplier: Mouser; Supplier Part Number: 71-CRCW060310K0JNEBC; Manufacturer Part Number: CRCW060310K0JNEBC; RoHS: Yes; Category: Chip SMD Resistors; Stock: 170759; Pricing: 1=0,1, 10=0,014, 50=0,014, 100=0,008, 1000=0,007, 10000=0,003 (USD); Pins: 2; Terminal Finish: Nickel; Min Operating Temperature: -55°C; Max Operating Temperature: 155°C; Tolerance: 5%; JESD-609 Code: e3; Resistor Type: FIXED RESISTOR; Construction: Chip; Package Style: SMTMeter; Packaging: Tape and Reel; Technology: METAL GLAZE/THICK FILM; Working Voltage: 75V; Reach SVHC Compliant: Yes; RoHS Compliant: Yes; ComponentLink1URL: https://datasheet.ciiva.com:443/pdfs/VipMasterIC/IC/VISH/VISH-S-A0003599164/VISH-S-A0003599164-1.pdf?src-supplier=IHS+Markit; ComponentLink1Description: https://datasheet.ciiva.com:443/pdfs/VipMasterIC/IC/VISH/VISH-S-A0003599164/VISH-S-A0003599164-1.pdf?src-supplier=IHS+Markit; ComponentLink2URL: http://www.vishay.com/docs/28773/crcwce3.pdf?src-supplier=Digikey; ComponentLink2Description: http://www.vishay.com/docs/28773/crcwce3.pdf?src-supplier=Digikey
R6 R8 R9 R12 R14 R17 R18 = R_0603_1kR_1%_1/10W: Res Thick Film 0603 1K Ohm 1% 1/10W ±100ppm/°C Molded SMD Paper T/R; Manufacturer: Vishay; Manufacturer Part Number: CRCW06031K00FKEAC; Power Rating: 100mW; Supplier 1: Digi-Key; RoHS: Yes; Category: Chip SMD Resistors; Stock 1: 2127199; Pricing 1: 1=0,10000, 10=0,03400, 100=0,01390, 1000=0,00624, 2500=0,00542 (USD); Mount: Surface Mount; Case/Package: Molded; Contact Plating: Tin; Min Operating Temperature: -55°C; Max Operating Temperature: 155°C; Tolerance: 1%; Resistor Type: Thick Film; Termination: Wraparound; Temperature Coefficient: 100ppm/°C; Length: 1.55mm; Lead Free: Lead Free; RoHS Compliant: Yes; ComponentLink1URL: http://www.vishay.com/docs/28773/crcwce3.pdf?src-supplier=Digi-Key; ComponentLink1Description: http://www.vishay.com/docs/28773/crcwce3.pdf?src-supplier=Digi-Key; Supplier Part Number 1: 541-3949-1-ND
SW1 = B_PushButton_PTS810SJM250SMTRLFS: SWITCHTACTILESPST-NO0.05A16V; Manufacturer: ITT C&K; Mechanical Life: 150000Cycles; Operating Force: 160gf; Throw Configuration: SPST; Current Rating: 50mA; Voltage Rating (DC): 16V; Illumination Type: Non-Illuminated; Switch Travel: 0.15mm; Switch Function: Off-Mom; Actuator Type: Standard; Supplier 1: Rs; RoHS: Yes; Category: Uncategorized; Stock 1: 152; Pricing 1: 1=165,28000 (GBP); Mounting Technology: Surface Mount; Case/Package: SMD/SMT; Color: Black; Contact Plating: Silver; Min Operating Temperature: -40°C; Max Operating Temperature: 85°C; Packaging: Tape and Reel; Termination: J-Bend; Package Quantity: 2900; Max Current Rating: 50mA; Orientation: Straight; Length: 3.2mm; Depth: 4.6mm; Lead Free: Lead Free; RoHS Compliant: Yes; ComponentLink1URL: https://datasheet.ciiva.com/24082/pts810-4mar13-248115-24082262.pdf?src-supplier=Mouser; ComponentLink1Description: https://datasheet.ciiva.com/24082/pts810-4mar13-248115-24082262.pdf?src-supplier=Mouser; ComponentLink2URL: https://datasheet.ciiva.com/18514/pts810-4mar13-18514059.pdf?src-supplier=Digi-Key; ComponentLink2Description: https://datasheet.ciiva.com/18514/pts810-4mar13-18514059.pdf?src-supplier=Digi-Key; ComponentLink3URL: https://datasheet.ciiva.com/18514/pts810-4mar13-18514060.pdf?src-supplier=Digi-Key; ComponentLink3Description: https://datasheet.ciiva.com/18514/pts810-4mar13-18514060.pdf?src-supplier=Digi-Key; ComponentLink4URL: https://datasheet.ciiva.com/18514/pts810-4mar13-18514058.pdf?src-supplier=Digi-Key; ComponentLink4Description: https://datasheet.ciiva.com/18514/pts810-4mar13-18514058.pdf?src-supplier=Digi-Key; Supplier Part Number 1: 1769461; Manufacturer Part Number: PTS810SJM250SMTRLFS
TP1 = TP_S2761-46R_SMT: Natural PC Test Point 0.063 x 0.031 x 0.045 (1.60mm x 0.80mm x 1.15mm) Brass, Tin Plating Surface Mount Mounting Type; Manufacturer: Harwin; Supplier: Digi-Key; Supplier Part Number: 952-2665-1-ND; Manufacturer Part Number: S2761-46R; RoHS: Yes; Category: Headers and Wire Housings; Stock: 224369; Pricing: 1=0,31000, 10=0,26400, 25=0,23280, 50=0,21380, 100=0,20540, 250=0,18444, 500=0,17604, 1000=0,14670 (USD); Mounting Technology: Surface Mount; Color: Natural; Plating: Tin; Body Material: Brass; Weight: 0.000212oz; Packaging: Cut Tape; Package Quantity: 3000; Series: S2761, EZ BoardWare; Length: 1.6mm; RoHS Compliant: Yes; ComponentLink1URL: https://cdn.harwin.com/pdfs/S2761R.pdf?src-supplier=Newark; ComponentLink1Description: https://cdn.harwin.com/pdfs/S2761R.pdf?src-supplier=Newark; ComponentLink2URL: https://cdn.harwin.com/pdfs/Harwin_PC_PCB_Hardware.pdf?src-supplier=Mouser; ComponentLink2Description: https://cdn.harwin.com/pdfs/Harwin_PC_PCB_Hardware.pdf?src-supplier=Mouser; ComponentLink3URL: https://cdn.harwin.com/pdfs/Harwin_PC_PCB_Hardware.pdf?src-supplier=Digi-Key; ComponentLink3Description: https://cdn.harwin.com/pdfs/Harwin_PC_PCB_Hardware.pdf?src-supplier=Digi-Key; ComponentLink4URL: https://cdn.harwin.com/pdfs/Harwin_PC_PCB_Hardware.pdf?src-supplier=TTI; ComponentLink4Description: https://cdn.harwin.com/pdfs/Harwin_PC_PCB_Hardware.pdf?src-supplier=TTI
U1 = U_STM32G070CBT6_LQFP-48: MCU 32-Bit ARM Cortex-M0+ RISC 128KB Flash 2V to 3.6V 48-Pin LQFP Tray; Manufacturer: STMicroelectronics; Supplier 1: Mouser; RoHS: No; Category: Microcontrollers; Stock 1: 50283; Pricing 1: 1=3,11000, 10=2,80000, 50=2,25000, 100=2,11000, 1000=1,53000, 10000=1,38000 (USD); ComponentLink1URL: https://4donline.ihs.com/images/VipMasterIC/IC/SGST/SGST-S-A0007407296/SGST-S-A0007407296-1.pdf?hkey=52A5661711E402568146F3353EA87419&src-supplier=Farnell; ComponentLink1Description: https://4donline.ihs.com/images/VipMasterIC/IC/SGST/SGST-S-A0007407296/SGST-S-A0007407296-1.pdf?hkey=52A5661711E402568146F3353EA87419&src-supplier=Farnell; ComponentLink2URL: https://www.st.com/resource/en/datasheet/stm32g070cb.pdf?src-supplier=Digi-Key; ComponentLink2Description: https://www.st.com/resource/en/datasheet/stm32g070cb.pdf?src-supplier=Digi-Key; ComponentLink3URL: https://www.mouser.com/datasheet/2/389/stm32g070cb-1517433.pdf?src-supplier=Avnet; ComponentLink3Description: https://www.mouser.com/datasheet/2/389/stm32g070cb-1517433.pdf?src-supplier=Avnet; Supplier Part Number 1: 511-STM32G070CBT6; Manufacturer Part Number: STM32G070CBT6
U2 = U_ISO6742DWR _SOIC-16: General-purpose, quad-channel, 2/2 digital isolator 16-SOIC -40 to 125; Manufacturer: Texas Instruments; Supplier 1: Mouser; RoHS: No; Category: Integrated Circuits (ICs); Stock 1: 20457; Pricing 1: 1=2,98000, 10=2,68000, 50=2,53000, 100=2,15000, 1000=1,47000, 10000=1,33000 (USD); Supplier Part Number 1: 595-ISO6742DWR; Manufacturer Part Number: ISO6742DWR
U3 U4 = U_LTV-846S_PDIP-16: LTV Series Quad Channel 80 V 5000 Vrms Transistor Output Optocoupler SMT -DIP-16; Manufacturer: Vishay Lite-On; Reverse Breakdown Voltage: 6V; Rise Time: 18000ns; Number of Channels: 4; Max Power Dissipation: 200mW; Collector Emitter Voltage (VCEO): 80V; Forward Voltage: 1.4V; Forward Current: 50mA; Collector Emitter Saturation Voltage: 200mV; Isolation Voltage: 5kV; Current Transfer Ratio: 600%; Input Type: DC; Supplier 1: Rs; RoHS: Yes; Category: Optocouplers; Stock 1: 575; Pricing 1: 25=0,02196 (GBP); Mounting Technology: Surface Mount; Case/Package: SMD/SMT; Pins: 16; Min Operating Temperature: -30°C; Max Operating Temperature: 100°C; Packaging: Rail/Tube; Package Quantity: 25; Max Collector Current: 50mA; Max Output Voltage: 80V; Output Current per Channel: 50mA; Fall Time: 18000ns; Number of Elements: 4; Power Dissipation: 200mW; Max Input Current: 50mA; Number of Circuits: 4; Output Voltage: 80V; Series: -; Collector-emitter Voltage-Max: 200mV; Isolation Voltage-Max: 5kV; Channels: 4; Radiation Hardening: No; Lead Free: Lead Free; RoHS Compliant: Yes; ComponentLink1URL: https://datasheet.ciiva.com/15118/getdatasheetpartid-104477-15118595.pdf?src-supplier=Verical; ComponentLink1Description: https://datasheet.ciiva.com/15118/getdatasheetpartid-104477-15118595.pdf?src-supplier=Verical; ComponentLink2URL: https://datasheet.ciiva.com/25765/0900766b80de4a4d-25765254.pdf?src-supplier=Allied+Electronics; ComponentLink2Description: https://datasheet.ciiva.com/25765/0900766b80de4a4d-25765254.pdf?src-supplier=Allied+Electronics; ComponentLink3URL: https://datasheet.ciiva.com/11772/0900766b80de4a4d-11772470.pdf?src-supplier=Rs; ComponentLink3Description: https://datasheet.ciiva.com/11772/0900766b80de4a4d-11772470.pdf?src-supplier=Rs; ComponentLink4URL: https://datasheet.ciiva.com/2086/s-110-ltv-816826846m-s-s-ta-s-ta1-s-tpseries-2086411.pdf?src-supplier=Digi-Key; ComponentLink4Description: https://datasheet.ciiva.com/2086/s-110-ltv-816826846m-s-s-ta-s-ta1-s-tpseries-2086411.pdf?src-supplier=Digi-Key; Supplier Part Number 1: 1689678; Manufacturer Part Number: LTV-846S
Y1 = Y_32.768KHz_FK135EIHM0.032768-T3: Crystal 0.032768MHz ±20ppm (Tol) 12.5pF Flexural 70000Ohm 2-Pin SMD T/R; Manufacturer: Fox Electronics; ESR (Equivalent Series Resistance): 70kR; Supplier 1: Arrow Electronics; RoHS: Yes; Stock 1: 9000; Pricing 1: 3000=0,44540, 6000=0,43660, 15000=0,40600 (USD); Mounting Technology: Surface Mount; Case/Package: SMD/SMT; Min Operating Temperature: -40°C; Max Operating Temperature: 85°C; Packaging: Tape and Reel; Frequency Tolerance: 20ppm; ComponentLink1URL: https://www.foxonline.com/pdfs/K135.pdf?src-supplier=Digi-Key; ComponentLink1Description: https://www.foxonline.com/pdfs/K135.pdf?src-supplier=Digi-Key; Supplier Part Number 1: FK135EIHM0.032768-T3; Manufacturer Part Number: FK135EIHM0.032768-T3
Y2 = Y_8MHz_NX5032GA-8.000M-STD-CSU-1: Crystal 8MHz +/-50ppm (Tol) +/-150ppm (Stability) 8pF FUND 300Ohm Automotive 2-Pin SMD; Manufacturer: NDK; ESR (Equivalent Series Resistance): 300R; Frequency Stability: 150ppm; Frequency Tolerance: 50ppm; Supplier 1: Rs; RoHS: Yes; Category: Crystals; Stock 1: 235; Pricing 1: 5=1,34600, 25=1,20400, 50=1,17200, 100=1,14200, 250=1,11600 (GBP); Mounting Technology: Surface Mount; Case/Package: SMD/SMT; Pins: 2; Min Operating Temperature: -40°C; Max Operating Temperature: 150°C; Packaging: Cut Tape; Length: 5mm; Width: 0.126inch; Height: 0.059inch; Depth: 3.2mm; Ratings: AEC-Q200; RoHS Compliant: Yes; ComponentLink1URL: https://media.digikey.com/pdf/Data%20Sheets/NDK%20PDFs/NX5032GA_STD-CSU-1,-2.pdf?src-supplier=Digi-Key; ComponentLink1Description: https://media.digikey.com/pdf/Data%20Sheets/NDK%20PDFs/NX5032GA_STD-CSU-1,-2.pdf?src-supplier=Digi-Key; ComponentLink2URL: https://www.verical.com/server-webapp/html/getDatasheet?partID=665129&src-supplier=Verical; ComponentLink2Description: https://www.verical.com/server-webapp/html/getDatasheet?partID=665129&src-supplier=Verical; Manufacturer Part Number: NX5032GA-8.000M-STD-CSU-1; Supplier Part Number 1: 1847981